# Altium schematic sheet ADC.SchDoc
size A3
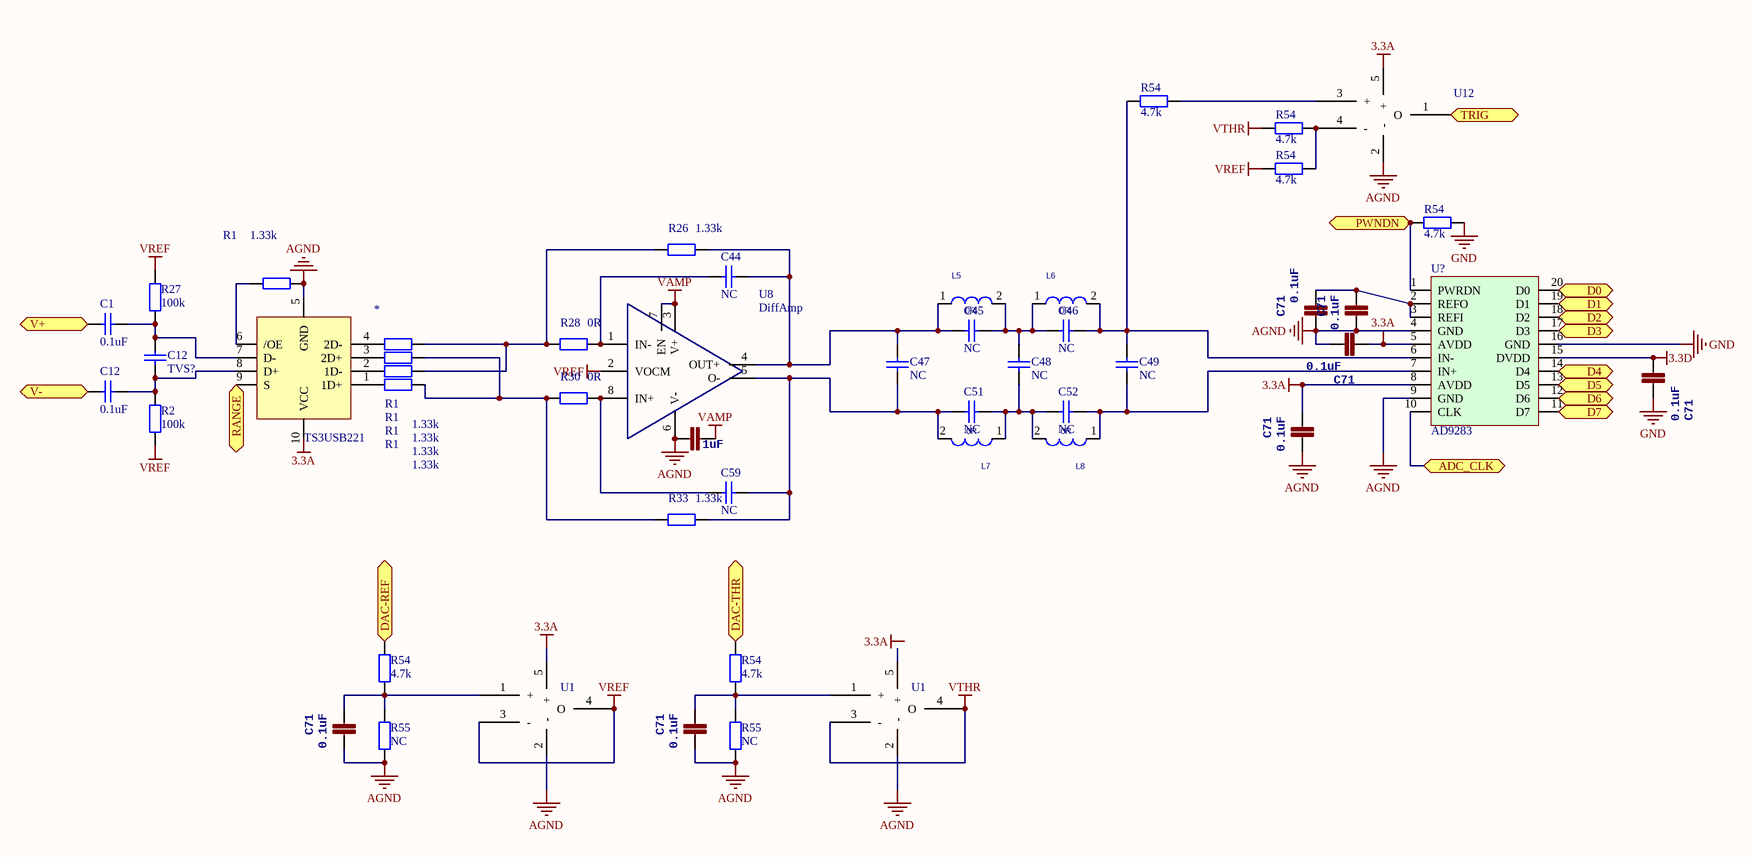
[diagram p0: ADC.SchDoc]

## Parts
(Parts that share a designator on the sheet are numbered #1, #2 ... from top to bottom, then left to right.)
*  TS3USB221  [TS3USB221]
C1  0.1uF  [0402]
C12#1  TVS?  [0402]
C12#2  0.1uF  [0402]
C44  NC  [0402]
C45  NC  [0402]
C46  NC  [0402]
C47  NC  [0402]
C48  NC  [0402]
C49  NC  [0402]
C51  NC  [0402]
C52  NC  [0402]
C59  NC  [0402]
C71#1  0.1uF  [0402]
C71#2  0.1uF  [0402]
C71#3  0.1uF  [0402]
C71#4  0.1uF  [0402]
C71#5  0.1uF  [0402]
C71#6  0.1uF  [0402]
C71#7  0.1uF  [0402]
C90  1uF  [0603]
L5  0R  [0402]
L6  0R  [0402]
L7  0R  [0402]
L8  0R  [0402]
R1#1  1.33k  [0402]
R1#2  1.33k  [0402]
R1#3  1.33k  [0402]
R1#4  1.33k  [0402]
R1#5  1.33k  [0402]
R2  100k  [0402]
R26  1.33k  [0402]
R27  100k  [0402]
R28  0R  [0402]
R30  0R  [0402]
R33  1.33k  [0402]
R54#1  4.7k  [0402]
R54#2  4.7k  [0402]
R54#3  4.7k  [0402]
R54#4  4.7k  [0402]
R54#5  4.7k  [0402]
R54#6  4.7k  [0402]
R55#1  NC  [0402]
R55#2  NC  [0402]
U1#1  OP-SOT23  [SOT23-5]  (value not drawn)
U1#2  OP-SOT23  [SOT23-5]  (value not drawn)
U8  DiffAmp  [MSOP8/VSSOP8]
U12  CMP-SOT23  [SOT23-5]  (value not drawn)
U?  AD9283  [SSOP20]

## Ports
ADC_CLK, D0, D1, D2, D3, D4, D5, D6, D7, DAC-REF, DAC-THR, PWNDN, RANGE, TRIG, V+, V-

## Nets
3.3A: *.10(VCC) C71#3.2 C71#5.1 U1#1.5(+) U12.5(+) U?.5(AVDD) U?.8(AVDD)
3.3D: C71#4.2 U?.15(DVDD)
AGND: *.5(GND) C71#1.2 C71#2.2 C71#3.1 C71#5.2 C71#6.2 C71#7.2 C90.2 R1#1.1 R55#1.2 R55#2.2 U1#1.2(-) U1#2.2(-) U8.6(V-) U12.2(-) U?.4(GND) U?.9(GND)
GND: C71#4.1 R54#4.1 U?.16(GND)
VAMP: C90.1 U8.3(V+) U8.7(EN)
VREF: R2.2 R27.1 R54#3.1 U1#1.3(-) U1#1.4(O) U8.2(VOCM)
VTHR: R54#2.1 U1#2.3(-) U1#2.4(O)
ADC_CLK: U?.10(CLK) ; port ADC_CLK
D0: U?.20(D0) ; port D0
D1: U?.19(D1) ; port D1
D2: U?.18(D2) ; port D2
D3: U?.17(D3) ; port D3
D4: U?.14(D4) ; port D4
D5: U?.13(D5) ; port D5
D6: U?.12(D6) ; port D6
D7: U?.11(D7) ; port D7
DAC-REF: R54#5.1 ; port DAC-REF
DAC-THR: R54#6.1 ; port DAC-THR
PWNDN: R54#4.2 U?.1(PWRDN) ; port PWNDN
RANGE: *.9(S) ; port RANGE
TRIG: U12.1(O) ; port TRIG
V+: C1.2 ; port V+
V-: C12#2.2 ; port V-
Net*_1: *.1(1D+) R1#5.2
Net*_2: *.2(1D-) R1#4.2
Net*_3: *.3(2D+) R1#3.2
Net*_4: *.4(2D-) R1#2.2
Net*_6: *.6(/OE) R1#1.2
Net*_7: *.7(D-) C1.1 C12#1.1 R27.2
Net*_8: *.8(D+) C12#1.2 C12#2.1 R2.1
NetC44_1: C44.1 C45.2 C47.2 L5.1 R26.1 U8.4(OUT+)
NetC44_2: C44.2 R28.1 U8.1(IN-)
NetC45_1: C45.1 C46.2 C48.2 L5.2 L6.1
NetC46_1: C46.1 C49.2 L6.2 R54#1.1 U?.6(IN-)
NetC47_1: C47.1 C51.1 C59.1 L7.2 R33.1 U8.5(O-)
NetC48_1: C48.1 C51.2 C52.1 L7.1 L8.2
NetC49_1: C49.1 C52.2 L8.1 U?.7(IN+)
NetC59_2: C59.2 R30.1 U8.8(IN+)
NetC71#1_1: C71#1.1 C71#2.1 U?.2(REFO) U?.3(REFI)
NetC71#6_1: C71#6.1 R54#5.2 R55#1.1 U1#1.1(+)
NetC71#7_1: C71#7.1 R54#6.2 R55#2.1 U1#2.1(+)
NetR1#2_1: R1#2.1 R1#4.1 R26.2 R28.2
NetR1#3_1: R1#3.1 R1#5.1 R30.2 R33.2
NetR54#1_2: R54#1.2 U12.3(+)
NetR54#2_2: R54#2.2 R54#3.2 U12.4(-)

Not connected (* = marked no-connect by the designer): U1#2 5(+)

## Notes on the sheet
- Labels drawn without touching a wire or pin: 3.3A

## Library data of the parts
C1 C12#1 C12#2 C44-C49 C51 C52 C59 = Cap: Capacitor; Published: 8-Jun-2000; LatestRevisionDate: 17-Jul-2002; LatestRevisionNote: Re-released for DXP Platform.; PackageReference: RAD-0.3; Publisher: Altium Limited; PackageDescription: Radial Cap, Thru-Hole; 2 Leads; 0.3 in Pin Spacing
C71#1-C71#7 C90 = CAP0402-CAP: <b>Capacitor</b> / Standard 0603 ceramic capacitor, and 0.1" leaded capacitor.; PARTNO: CC0402ZRY5V7BB104
L5-L8 = L/2.5*2.0
R1#1-R1#5 R2 R26-R28 R30 R33 = Res2: Resistor; Value: 0Ohm; Published: 8-Jun-2000; LatestRevisionDate: 17-Jul-2002; LatestRevisionNote: Re-released for DXP Platform.; PackageReference: AXIAL-0.4; Publisher: Altium Limited; PackageDescription: Axial Device, Thru-Hole; 2 Leads; 0.4 in Pin Spacing
R54#1-R54#6 R55#1 R55#2 = Res2: Resistor; Published: 8-Jun-2000; LatestRevisionDate: 17-Jul-2002; LatestRevisionNote: Re-released for DXP Platform.; PackageReference: AXIAL-0.4; Publisher: Altium Limited; PackageDescription: Axial Device, Thru-Hole; 2 Leads; 0.4 in Pin Spacing